# Altium schematic sheet CAN Interface.SchDoc
size A; SheetNumber: 6; SheetTotal: 6
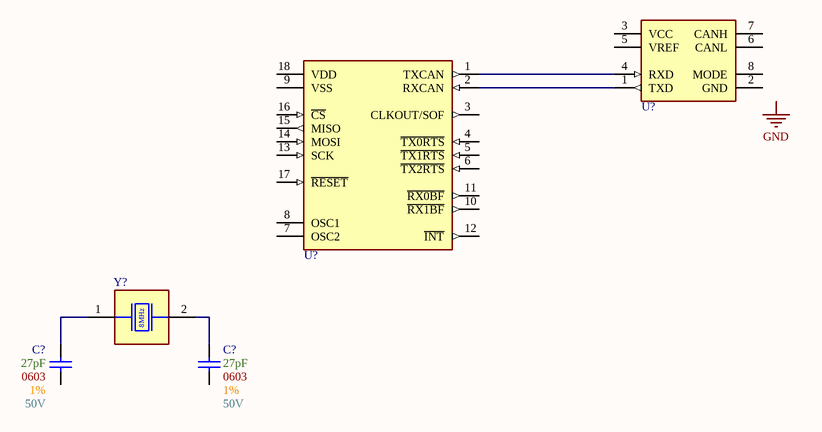
[diagram p0: CAN Interface.SchDoc]

## Parts
(Parts that share a designator on the sheet are numbered #1, #2 ... from top to bottom, then left to right.)
C?#1  Max Voltage: 50V  Size Package: 0603  Tolerance: 1%  Capacitance: 27pF  [[Cap] SMD 0603]  (hidden comment: [Cap] 0603 27pF 1% 50V)
C?#2  Max Voltage: 50V  Size Package: 0603  Tolerance: 1%  Capacitance: 27pF  [[Cap] SMD 0603]  (hidden comment: [Cap] 0603 27pF 1% 50V)
U?#1  [CAN] CAN-FD Frontend  [8-SOIC]  (value not drawn)
U?#2  [CAN] SPI - Single-Ended CAN  [18-SOIC]  (value not drawn)
Y?  [Crystal] SMD 8MHz  [[Crystal] SMD 8MHz]  (value not drawn)

## Nets
NetC?#1_2: C?#1.2 Y?.1(XTAL1)
NetC?#2_2: C?#2.2 Y?.2(XTAL2)
NetU?#1_1: U?#1.1(TXD) U?#2.2(RXCAN)
NetU?#1_4: U?#1.4(RXD) U?#2.1(TXCAN)

Not connected (* = marked no-connect by the designer): C?#1 1; C?#2 1; U?#1 2(GND) 3(VCC) 5(VREF) 6(CANL) 7(CANH) 8(MODE); U?#2 3(CLKOUT/SOF) 4(~{TX0RTS}) 5(~{TX1RTS}) 6(~{TX2RTS}) 7(OSC2) 8(OSC1) 9(VSS) 10(~{RX1BF}) 11(~{RX0BF}) 12(~{INT}) 13(SCK) 14(MOSI) 15(MISO) 16(~{CS}) 17(~{RESET}) 18(VDD)

## Notes on the sheet
- Labels drawn without touching a wire or pin: GND
- (in symbol [Crystal] SMD 8MHz) 8MHz

## Library data of the parts
C?#1 C?#2 = [Cap] 0603 27pF 1% 50V: 0603N270F500CT; Supplier 1: DigiKey; Supplier Part Number 1: 1292-1510-1-ND
U?#1 = [CAN] CAN-FD Frontend: TJA1050T/CM,118; Supplier 1: DigiKey; Supplier Part Number 1: 568-10292-1-ND
U?#2 = [CAN] SPI - Single-Ended CAN: MCP2515T-I/SO; Supplier 1: DigiKey; Supplier Part Number 1: MCP2515T-I/SODKR-ND
Y? = [Crystal] SMD 8MHz: ABM3-8.000MHZ-D2Y-T; Supplier 1: DigiKey; Supplier Part Number 1: 535-10630-1-ND